# EAGLE design Clock1 (EAGLE 9.5.2)
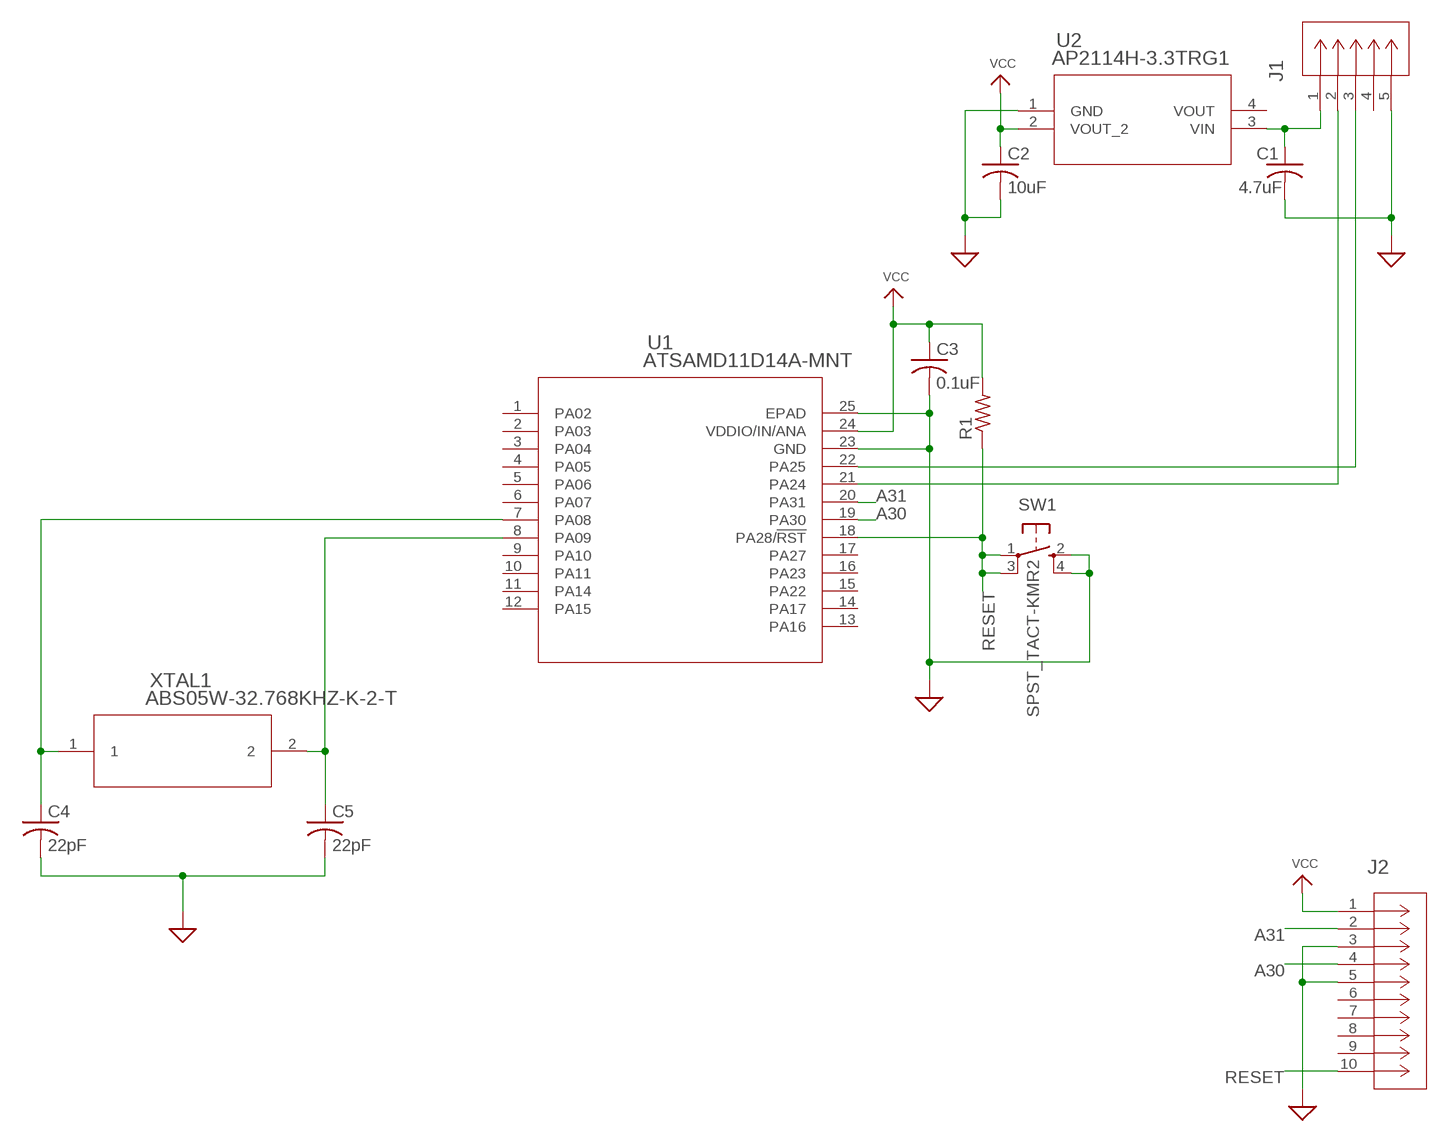
[diagram p0: schematic, sheet 1, part 1 of 2]
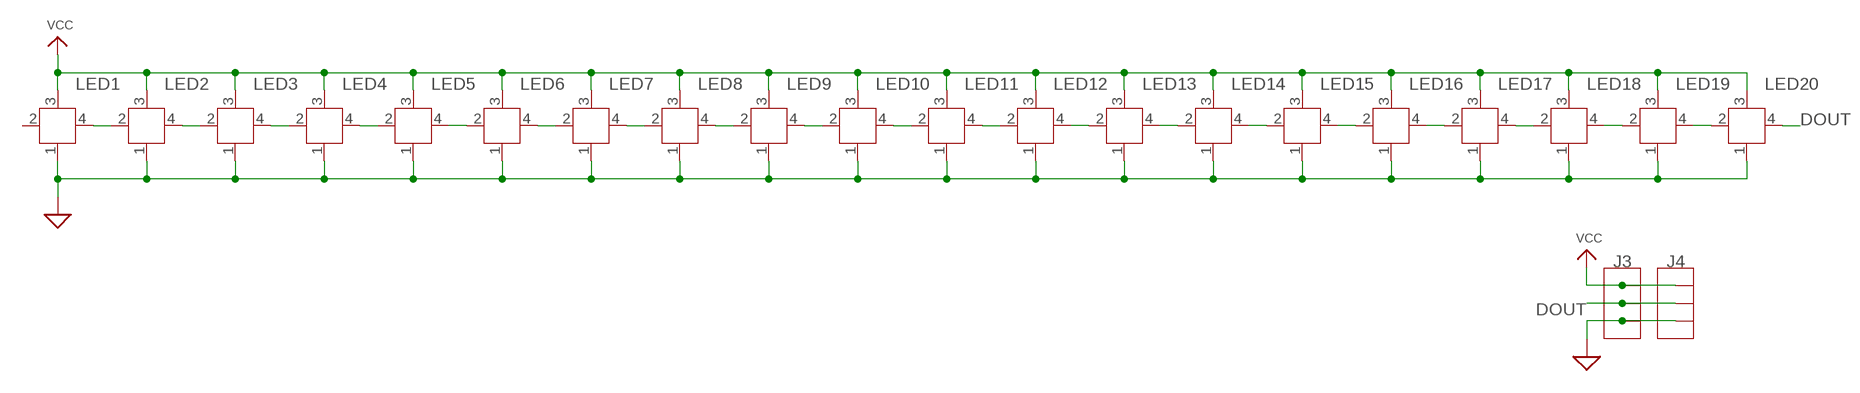
[diagram p1: schematic, sheet 1, part 2 of 2]

## Parts
C1  4.7uF  C-USC0805  [C0805]
C2  10uF  C-USC0805  [C0805]
C3  0.1uF  C-USC0402  [C0402]
C4  22pF  C-USC0402  [C0402]
C5  22pF  C-USC0402  [C0402]
J1  1050171001  [CON00679_5]
J2  20021121-00010C4LF  [CONN_00010C4LF]
J3  HEADER_1X3FEMALE  [F3SMD]
J4  HEADER_1X3FEMALE  [F3SMD]
LED1  WS2812B  [SK6812]
LED2  WS2812B  [SK6812]
LED3  WS2812B  [SK6812]
LED4  WS2812B  [SK6812]
LED5  WS2812B  [SK6812]
LED6  WS2812B  [SK6812]
LED7  WS2812B  [SK6812]
LED8  WS2812B  [SK6812]
LED9  WS2812B  [SK6812]
LED10  WS2812B  [SK6812]
LED11  WS2812B  [SK6812]
LED12  WS2812B  [SK6812]
LED13  WS2812B  [SK6812]
LED14  WS2812B  [SK6812]
LED15  WS2812B  [SK6812]
LED16  WS2812B  [SK6812]
LED17  WS2812B  [SK6812]
LED18  WS2812B  [SK6812]
LED19  WS2812B  [SK6812]
LED20  WS2812B  [SK6812]
R1  R-US_R0402  [R0402]
SW1  SPST_TACT-KMR2  [KMR2]
U1  ATSAMD11D14A-MNT  [QFN24_4X4MC]
U2  AP2114H-3.3TRG1  [SOT-223]
XTAL1  ABS05W-32.768KHZ-K-2-T  [XTAL_ABS05]

## Nets
A30: J2.4 U1.19(PA30)
A31: J2.2 U1.20(PA31)
DOUT: J3.2A J3.2B J4.2A J4.2B LED20.4(DOUT)
GND: C1.2 C2.2 C3.2 C4.2 C5.2 J1.5 J2.3 J2.5 J3.3A J3.3B J4.3A J4.3B LED1.1(VSS) LED2.1(VSS) LED3.1(VSS) LED4.1(VSS) LED5.1(VSS) LED6.1(VSS) LED7.1(VSS) LED8.1(VSS) LED9.1(VSS) LED10.1(VSS) LED11.1(VSS) LED12.1(VSS) LED13.1(VSS) LED14.1(VSS) LED15.1(VSS) LED16.1(VSS) LED17.1(VSS) LED18.1(VSS) LED19.1(VSS) LED20.1(VSS) SW1.2(S) SW1.4(S1) U1.23(GND) U1.25(EPAD) U2.1(GND) ; supply symbol labelled SUP
N$1: J1.3 U1.22(PA25)
N$2: J1.2 U1.21(PA24)
N$4: C4.1 U1.7(PA08) XTAL1.1
N$5: C5.1 U1.8(PA09) XTAL1.2
N$8: LED19.4(DOUT) LED20.2(DIN)
N$9: LED18.4(DOUT) LED19.2(DIN)
N$10: LED17.4(DOUT) LED18.2(DIN)
N$11: LED16.4(DOUT) LED17.2(DIN)
N$12: LED15.4(DOUT) LED16.2(DIN)
N$13: LED14.4(DOUT) LED15.2(DIN)
N$14: LED13.4(DOUT) LED14.2(DIN)
N$15: LED12.4(DOUT) LED13.2(DIN)
N$16: LED11.4(DOUT) LED12.2(DIN)
N$17: LED10.4(DOUT) LED11.2(DIN)
N$18: LED9.4(DOUT) LED10.2(DIN)
N$19: LED8.4(DOUT) LED9.2(DIN)
N$20: LED7.4(DOUT) LED8.2(DIN)
N$21: LED1.4(DOUT) LED2.2(DIN)
N$22: LED2.4(DOUT) LED3.2(DIN)
N$23: LED3.4(DOUT) LED4.2(DIN)
N$24: LED4.4(DOUT) LED5.2(DIN)
N$25: LED5.4(DOUT) LED6.2(DIN)
N$26: LED6.4(DOUT) LED7.2(DIN)
RESET: J2.10 R1.1 SW1.1(P) SW1.3(P1) U1.18(PA28/!RST)
VCC: C2.1 C3.1 J2.1 J3.1A J3.1B J4.1A J4.1B LED1.3(VDD) LED2.3(VDD) LED3.3(VDD) LED4.3(VDD) LED5.3(VDD) LED6.3(VDD) LED7.3(VDD) LED8.3(VDD) LED9.3(VDD) LED10.3(VDD) LED11.3(VDD) LED12.3(VDD) LED13.3(VDD) LED14.3(VDD) LED15.3(VDD) LED16.3(VDD) LED17.3(VDD) LED18.3(VDD) LED19.3(VDD) LED20.3(VDD) R1.2 U1.24(VDDIO/IN/ANA) U2.2(VOUT_2)
VIN: C1.1 J1.1 U2.3(VIN)
Unconnected: J1.4 J2.6 J2.7 J2.8 J2.9 LED1.2(DIN) U1.1(PA02) U1.2(PA03) U1.3(PA04) U1.4(PA05) U1.5(PA06) U1.6(PA07) U1.9(PA10) U1.10(PA11) U1.11(PA14) U1.12(PA15) U1.13(PA16) U1.14(PA17) U1.15(PA22) U1.16(PA23) U1.17(PA27) U2.4(VOUT)

## Library data of the parts
C1-C5 = adafruit:C-US: CAPACITOR, American symbol
J1 = Clock:1050171001; BUILT_BY: EMA_Don; COPYRIGHT: Copyright (C) 2016 Accelerated Designs. All rights reserved; MANUFACTURER_PART_NUMBER: 1050171001; VENDOR: Molex Connector Corporation
J2 = Clock:20021121-00010C4LF; BUILT_BY: EMA_Matt; COPYRIGHT: Copyright (C) 2018 Accelerated Designs. All rights reserved; MANUFACTURER_PART_NUMBER: 20021121-00010C4LF; VENDOR: Amphenol
J3 J4 = Clock:HEADER_1X3
LED1-LED20 = Clock:WS2812B
R1 = adafruit:R-US_: RESISTOR, American symbol
SW1 = adafruit:SPST_TACT: SMT 6mm switch, EVQQ2 series http://www.ladyada.net/library/eagle
U1 = Clock:ATSAMD11D14A-MNT; BUILT_BY: EMA_Molly; COPYRIGHT: Copyright (C) 2018 Accelerated Designs. All rights reserved; MANUFACTURER_PART_NUMBER: ATSAMD11D14A-MNT; VENDOR: Microchip
U2 = Clock:AP2114H-3.3TRG1; BUILT_BY: EMA_UL_Team; MANUFACTURER_PART_NUMBER: AP2114H-3.3TRG1; VENDOR: Diodes Inc
XTAL1 = Clock:ABS05W-32.768KHZ-K-2-T; BUILT_BY: EMA_Matt; COPYRIGHT: Copyright (C) 2018 Accelerated Designs. All rights reserved; MANUFACTURER_PART_NUMBER: ABS05W-32.768KHZ-K-2-T; VENDOR: Abracon

## Board
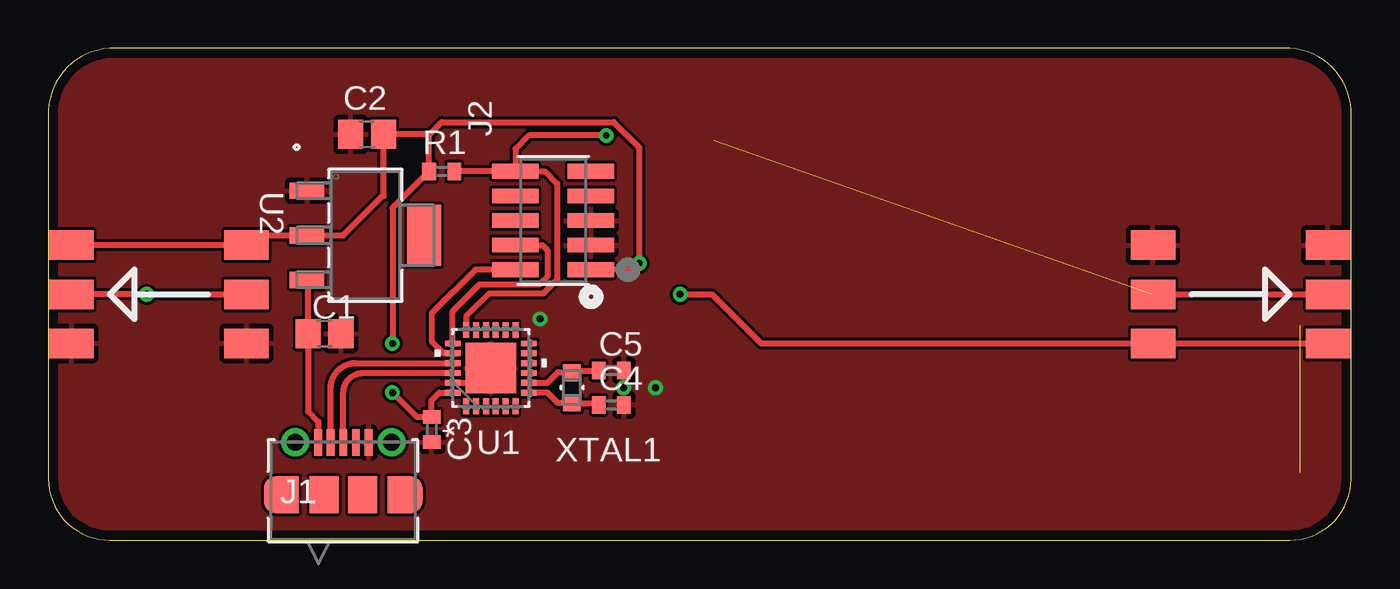
[diagram p2: board, top side]
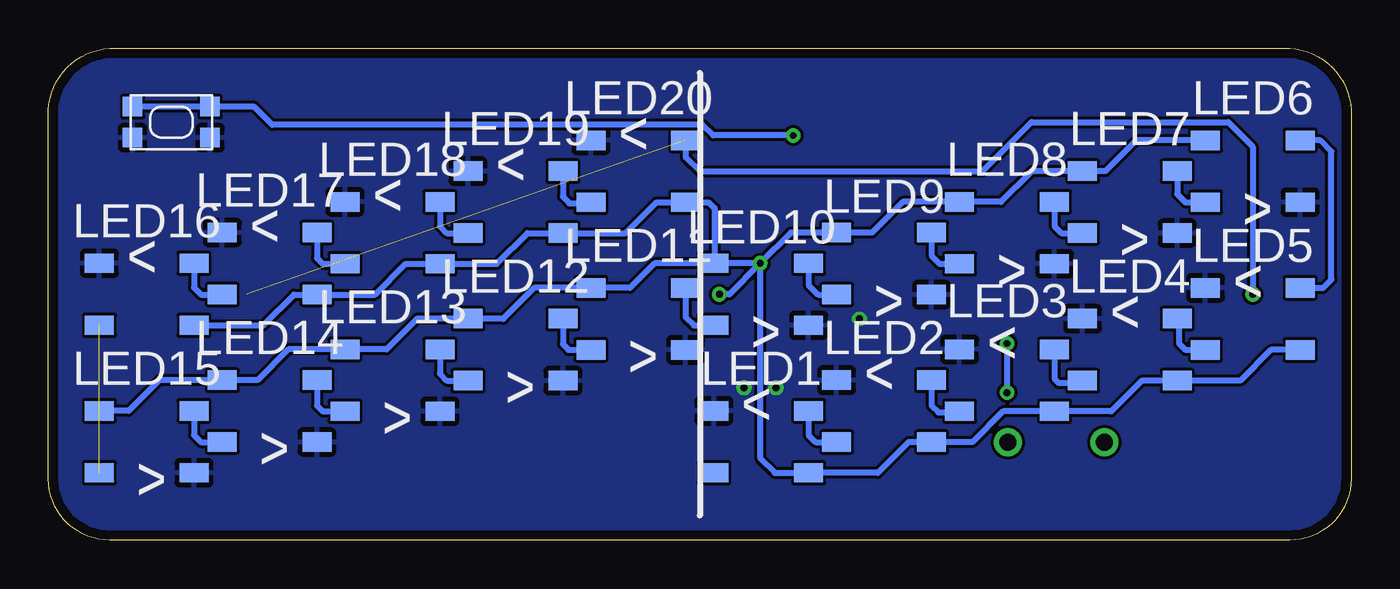
[diagram p3: board, bottom side, seen from below]

Size 67.31 x 25.4 mm. Coordinates in mm from the lower left corner, seen from the top.
Outline: 67.31,3.17 67.31,21.89 arc90 64.14,25.4 3.18,25.4 arc90 0,21.89 0,3.17 arc90 3.18,0 64.14,0 arc90 67.31,3.17
Copper layers (1*16): Top 0.035mm / dielectric 1.5mm / Bottom 0.035mm
Design rules "default *": minimum track width 6mil, minimum drill 0.35mm, track to track 6mil, track to pad 6mil, pad to pad 6mil, via to via 6mil, smd to smd 6mil, copper to edge 20mil, drill to drill 6mil, minimum pad ring 10mil, minimum via ring 8mil, stop-mask expansion 4mil, vias tented up to drill 0mil, thermal gap 10mil

### Footprints (pad centres in the part's own frame; a part is rotated, then mirrored left to right if it is on the bottom)
C0805 = smd 1.3 x 1.5: 1 -0.85,0; 2 0.85,0
C0402 = smd 0.7 x 0.9: 1 -0.65,0; 2 0.65,0
CON00679_5 = smd 0.406 x 1.346: 1 -1.302,2.504; 2 -0.652,2.504; 3 -0.002,2.504; 4 0.648,2.504; 5 1.298,2.504 | drill 0.864 pad 1.448: 6 -2.489,2.515; 7 2.489,2.515 | smd 1.499 x 1.905: 8 -1.002,-0.196; 9 0.998,-0.196 | smd 1.194 x 1.905: 10 -3.502,-0.196; 11 3.498,-0.196 | smd 1.201 x 1.905: 12 -2.902,-0.196; 13 2.898,-0.196
CONN_00010C4LF = smd 0.762 x 2.388: 1 -5.08,-3.9; 2 -5.08,0; 3 -3.81,-3.9; 4 -3.81,0; 5 -2.54,-3.9; 6 -2.54,0; 7 -1.27,-3.9; 8 -1.27,0; 9 0,-3.9; 10 0,0
F3SMD = smd 1.524 x 2.286: 1A -2.54,4.521; 1B -2.54,-4.521; 2A 0,4.521; 2B 0,-4.521; 3A 2.54,4.521; 3B 2.54,-4.521
SK6812 = smd 1.5 x 1: 1 -2.45,1.6; 2 -2.45,-1.6; 3 2.45,-1.6; 4 2.45,1.6
R0402 = smd 0.7 x 0.9: 1 -0.65,0; 2 0.65,0
KMR2 = smd 1 x 1: 1 2,0.8; 2 2,-0.8; 3 -2,0.8; 4 -2,-0.8
QFN24_4X4MC = smd 0.813 x 0.305: 1 -1.968,1.27; 2 -1.968,0.762; 3 -1.968,0.254; 4 -1.968,-0.254; 5 -1.968,-0.762; 6 -1.968,-1.27; 13 1.968,-1.27; 14 1.968,-0.762; 15 1.968,-0.254; 16 1.968,0.254; 17 1.968,0.762; 18 1.968,1.27 | smd 0.305 x 0.813: 7 -1.27,-1.968; 8 -0.762,-1.968; 9 -0.254,-1.968; 10 0.254,-1.968; 11 0.762,-1.968; 12 1.27,-1.968; 19 1.27,1.968; 20 0.762,1.968; 21 0.254,1.968; 22 -0.254,1.968; 23 -0.762,1.968; 24 -1.27,1.968 | smd 2.591 x 2.591: 25 0,0
SOT-223 = smd 0.851 x 1.761: 1 -2.3,-3.025; 2 0,-3.025; 3 2.3,-3.025 | smd 3.151 x 1.761: 4 0,3.025
XTAL_ABS05 = smd 0.813 x 0.914: 1 -0.8,0; 2 0.8,0

### Placement (x,y rotation side)
C1  14.26,10.67 0 top
C2  16.47,20.95 180 top
C3  19.81,5.71 270 top
C4  29.08,6.99 0 top
C5  29.08,8.76 0 top
J1  15.24,2.54 0 top
J2  24.13,19.05 90 top
J3  5.72,12.7 270 top
J4  61.6,12.7 90 top
LED1  30.48,5.08 0 bottom
LED2  24.13,6.67 0 bottom
LED3  17.78,8.26 0 bottom
LED4  11.43,9.84 0 bottom
LED5  5.08,11.43 0 bottom
LED6  5.08,19.05 180 bottom
LED7  11.43,17.46 180 bottom
LED8  17.78,15.88 180 bottom
LED9  24.13,14.29 180 bottom
LED10  30.48,12.7 180 bottom
LED11  36.83,11.43 180 bottom
LED12  43.18,9.84 180 bottom
LED13  49.53,8.26 180 bottom
LED14  55.88,6.67 180 bottom
LED15  62.23,5.08 180 bottom
LED16  62.23,12.7 0 bottom
LED17  55.88,14.29 0 bottom
LED18  49.53,15.88 0 bottom
LED19  43.18,17.46 0 bottom
LED20  36.83,19.05 0 bottom
R1  20.32,19.05 180 top
SW1  60.96,21.59 0 bottom
U1  22.86,8.89 90 top
U2  16.38,15.75 270 top
XTAL1  27.05,7.87 90 top

### Tracks (layer width: path | path; a pad name or v marks a point on that pad's centre or on a via)
A30
  Top 0.305: U1.19 20.89,11.83 22.27,13.21 25.37,13.21 25.78,13.62 25.78,14.99 25.53,15.24 J2.4
A31
  Top 0.305: U1.20 20.41,9.65 19.81,10.25 19.81,11.71 22.07,13.97 J2.2
DOUT  (via drill 0.35)  (1 unrouted)
  Top 0.305: J4.2A J4.2B | J3.2B v5.08,12.7 J3.2A
  Bottom 0.305: v5.08,12.7 5.08,20.32 6.35,21.59 16.51,21.59 19.05,19.05 33.66,19.05 34.38,19.77 LED20.4
GND  (via drill 0.35)
  Top 0.305: U1.23 22.1,8.13 U1.25
  other vias: 29.72,7.87 25.4,11.43 31.37,7.87
  pour Top: -2.54,-2.54 69.85,-2.54 69.85,27.94 -2.54,27.94
  pour Bottom: -2.54,-2.54 69.85,-2.54 69.85,27.94 -2.54,27.94
N$1
  Top 0.305: J1.3 15.24,7.62 arc-90 16.26,8.64 U1.22
N$2
  Top 0.305: J1.2 14.59,7.87 arc-90 15.86,9.14 U1.21
N$4
  Top 0.305: U1.7 25.78,7.62 26.33,7.07 XTAL1.1 28.34,7.07 C4.1
N$5
  Top 0.305: U1.8 25.78,8.13 26.33,8.67 XTAL1.2 27.14,8.76 C5.1
N$8
  Bottom 0.305: LED19.4 40.73,17.74 40.39,17.4 39.33,17.4 LED20.2
N$9
  Bottom 0.305: LED18.4 47.08,16.22 46.72,15.86 LED19.2
N$10
  Bottom 0.305: LED17.4 53.43,14.57 53.14,14.28 LED18.2
N$11
  Bottom 0.305: LED16.4 59.78,13.04 59.42,12.69 LED17.2
N$12  (1 unrouted)
N$13
  Bottom 0.305: LED15.2 59.78,5.42 59.42,5.07 LED14.4
N$14
  Bottom 0.305: LED14.2 53.43,6.95 53.14,6.66 LED13.4
N$15
  Bottom 0.305: LED13.2 47.08,8.6 46.72,8.24 LED12.4
N$16
  Bottom 0.305: LED12.2 40.73,10.12 40.44,9.83 LED11.4
N$17
  Bottom 0.305: LED11.2 34.38,11.52 33.96,11.1 LED10.4
N$18
  Bottom 0.305: LED10.2 28.03,13.17 27.55,12.69 LED9.4
N$19
  Bottom 0.305: LED9.2 21.68,14.7 21.26,14.28 LED8.4
N$20
  Bottom 0.305: LED8.2 15.33,16.22 14.97,15.86 LED7.4
N$21
  Bottom 0.305: LED1.4 28.03,5.42 27.67,5.07 LED2.2
N$22
  Bottom 0.305: LED2.4 21.68,6.95 21.34,6.6 20.28,6.6 LED3.2
N$23
  Bottom 0.305: LED3.4 15.33,8.35 15.11,8.13 14,8.13 LED4.2
N$24
  Bottom 0.305: LED4.4 8.89,11.35 8.89,10.16 8.56,9.83 LED5.2
N$25
  Bottom 0.305: LED5.4 1.45,13.03 1.02,13.46 1.02,20.07 1.6,20.65 LED6.2
N$26
  Bottom 0.305: LED7.2 8.98,17.87 8.56,17.45 LED6.4
RESET  (via drill 0.35)
  Top 0.305: J2.10 R1.1 | J2.10 24.13,20.19 24.84,20.91 v28.83,20.91 | U1.18 21.59,11.56 22.78,12.75 25.58,12.75 26.29,13.46 26.29,18.41 25.65,19.05 J2.10
  Bottom 0.305: v28.83,20.91 32.96,20.91 33.5,21.45 55.75,21.45 56.68,22.39 SW1.1 SW1.3
VCC  (via drill 0.35)
  Top 0.305: 19.69,20.95 19.67,20.94 R1.2 17.78,17.16 v17.78,10.16 | 19.69,20.95 20.32,21.59 29.21,21.59 30.53,20.27 v30.53,14.3 30.2,13.97 J2.1 | U1.24 20.19,7.62 19.81,7.24 C3.1 19.04,6.37 v17.78,7.62 | 19.69,20.95 C2.1 17.32,17.78 17.27,17.78 15.24,15.75 U2.2 10.74,15.75 J3.1A | J4.1B J4.1A 36.83,10.16 34.29,12.7 v32.64,12.7 | 9.19,15.24 J3.1A | J3.1A J3.1B
  Bottom 0.305: LED5.3 4.14,9.83 5.73,8.24 LED4.3 10.81,8.24 12.4,6.66 LED3.3 17.98,6.66 19.57,5.07 LED2.3 22.87,5.07 24.46,3.48 LED1.3 29.77,3.48 30.53,4.24 v30.53,14.3 | LED6.3 11.1,20.65 12.69,19.06 LED7.3 16.5,19.06 18.09,17.48 LED8.3 23.17,17.48 24.75,15.89 LED9.3 28.94,15.89 v30.53,14.3 | v30.53,14.3 LED10.3 | LED10.3 35.99,14.3 37.26,13.03 LED11.3 42.22,13.03 43.82,11.43 45.72,11.43 45.71,11.44 LED12.3 48.25,11.44 49.84,9.86 LED13.3 54.92,9.86 56.5,8.27 LED14.3 61.58,8.27 63.17,6.68 LED15.3 | LED16.3 56.21,11.1 54.62,12.69 LED17.3 50.43,12.69 48.84,14.28 LED18.3 44.15,14.28 42.56,15.86 LED19.3 37.48,15.86 35.89,17.45 LED20.3 33.2,17.45 32.89,17.14 32.89,14.34 LED10.3 | v17.78,10.16 v17.78,7.62 | v30.53,14.3 32.13,12.7 v32.64,12.7
VIN
  Top 0.305: U2.3 13.41,13.38 C1.1 13.41,6.65 13.94,6.13 J1.1 13.94,5.21